# EAGLE design led_strip (EAGLE 5.06)
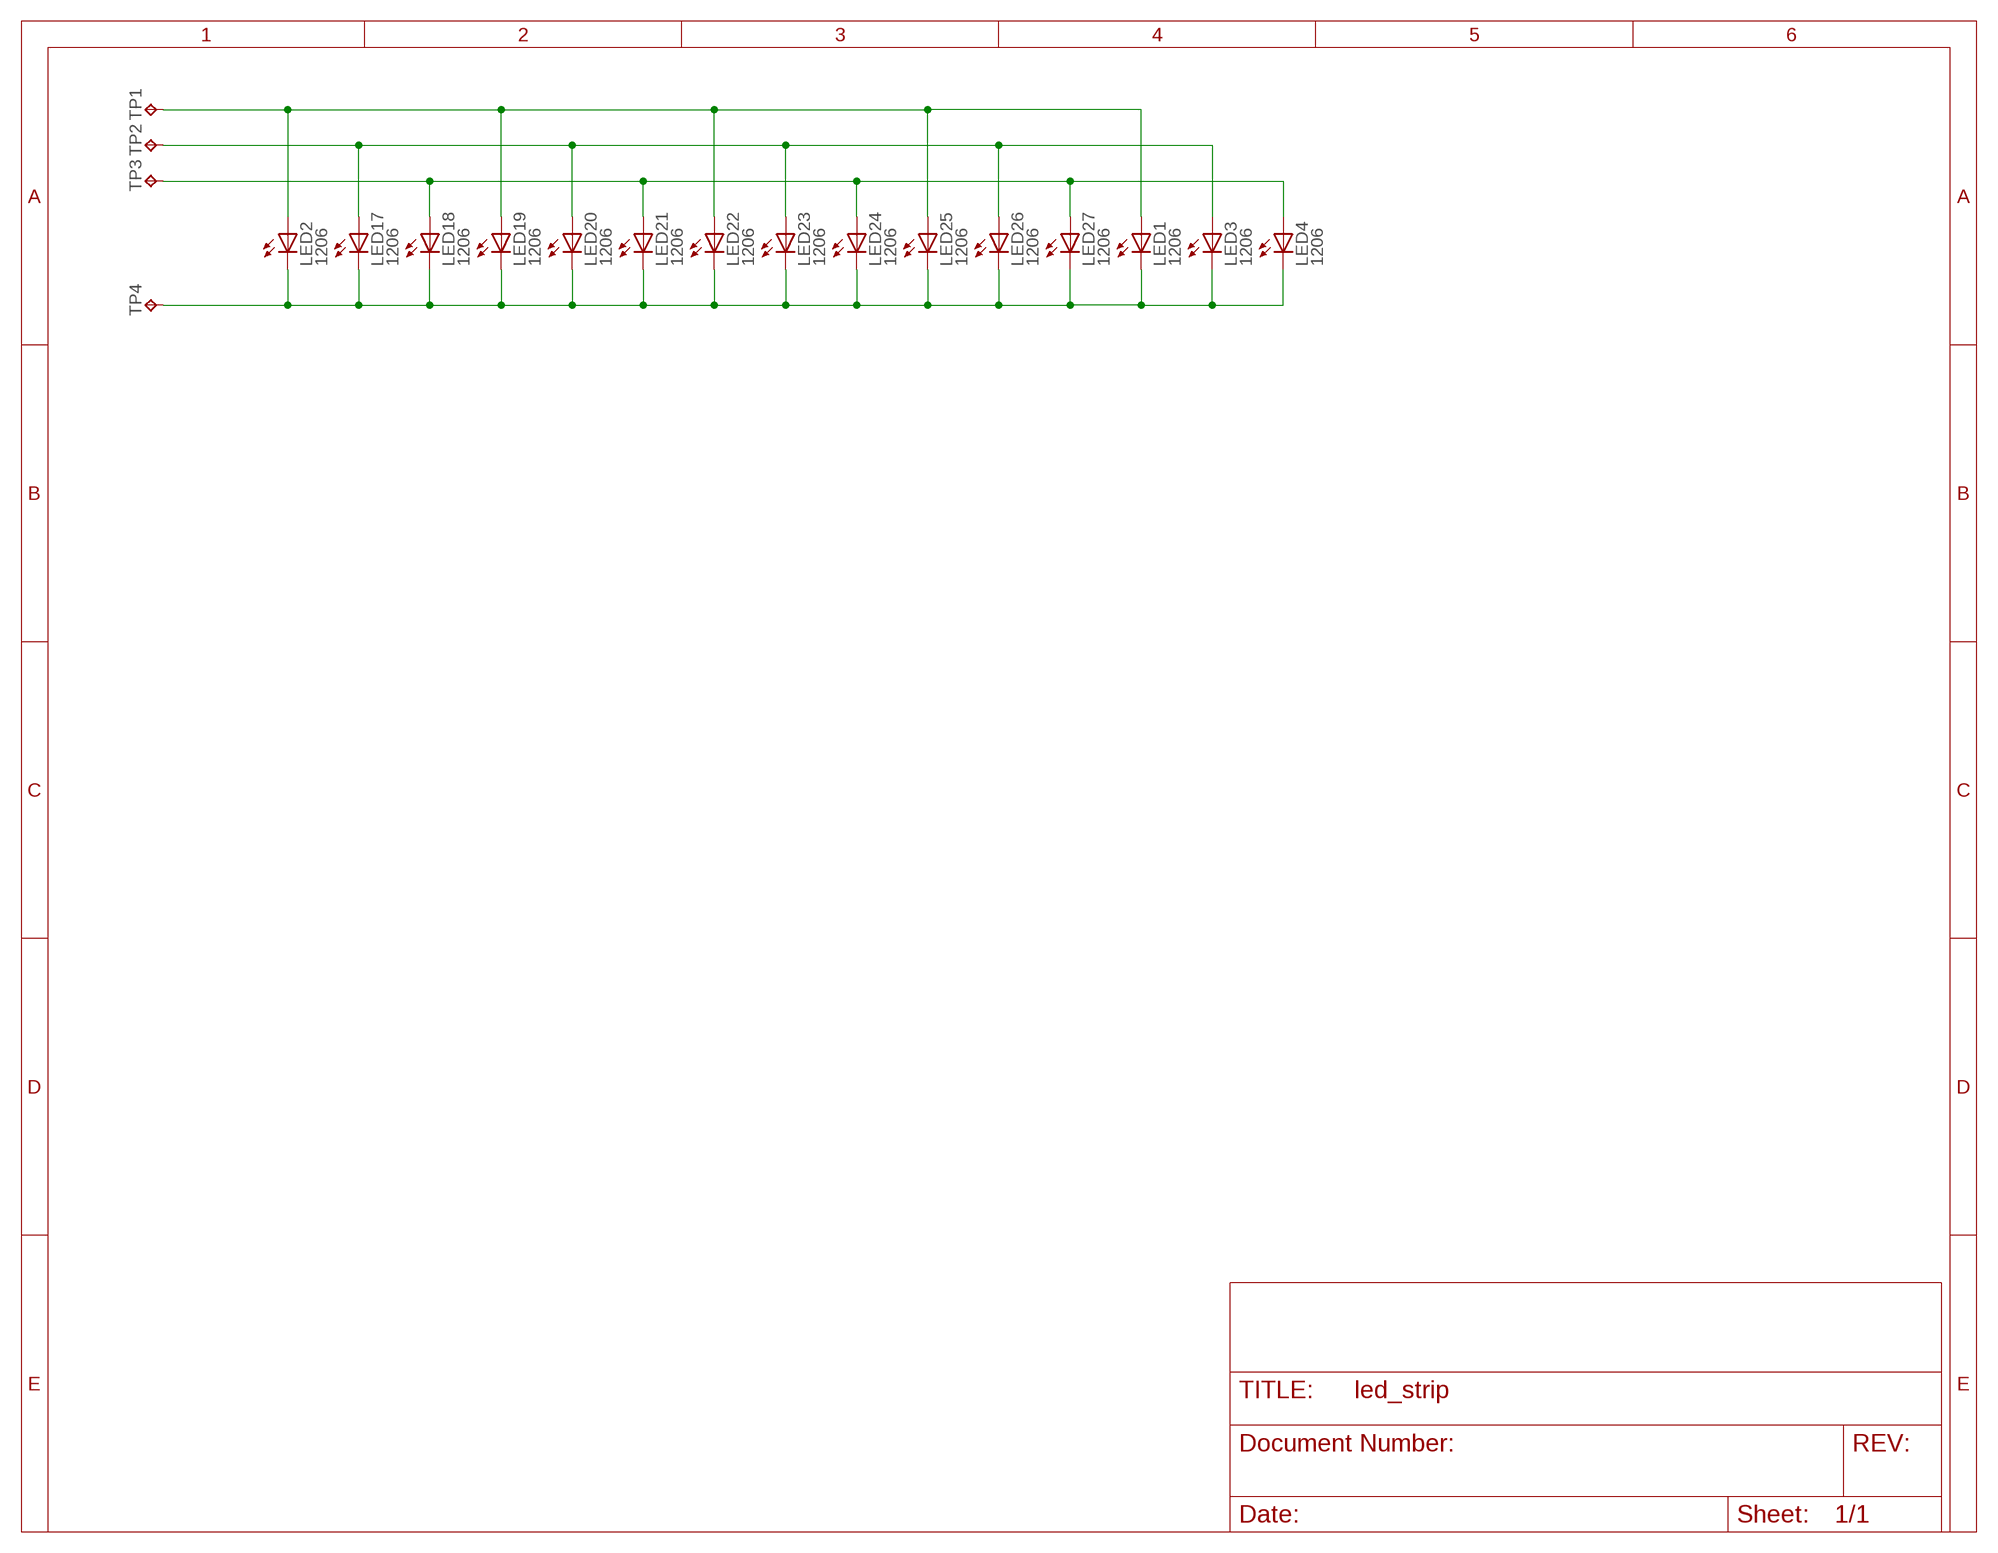
[diagram p0: schematic, sheet 1]

## Parts
LED1  1206  LEDSMT1206  [1206]
LED2  1206  LEDSMT1206  [1206]
LED3  1206  LEDSMT1206  [1206]
LED4  1206  LEDSMT1206  [1206]
LED17  1206  LEDSMT1206  [1206]
LED18  1206  LEDSMT1206  [1206]
LED19  1206  LEDSMT1206  [1206]
LED20  1206  LEDSMT1206  [1206]
LED21  1206  LEDSMT1206  [1206]
LED22  1206  LEDSMT1206  [1206]
LED23  1206  LEDSMT1206  [1206]
LED24  1206  LEDSMT1206  [1206]
LED25  1206  LEDSMT1206  [1206]
LED26  1206  LEDSMT1206  [1206]
LED27  1206  LEDSMT1206  [1206]
TP1  1.1  TPTP10SQ  [TP10SQ]
TP2  1.2  TPTP10SQ  [TP10SQ]
TP3  1.3  TPTP10SQ  [TP10SQ]
TP4  1.4  TPTP10SQ  [TP10SQ]

## Nets
LED1.1: LED1.A LED2.A LED19.A LED22.A LED25.A TP1.TP
LED1.2: LED3.A LED17.A LED20.A LED23.A LED26.A TP2.TP
LED1.3: LED4.A LED18.A LED21.A LED24.A LED27.A TP3.TP
LED1.4: LED1.C LED2.C LED3.C LED4.C LED17.C LED18.C LED19.C LED20.C LED21.C LED22.C LED23.C LED24.C LED25.C LED26.C LED27.C TP4.TP

## Library data of the parts
LED1-LED4 LED17-LED27 = led:LED: LED OSRAM: - CHIPLED LG R971, LG N971, LY N971, LG Q971, LY Q971, LO R971, LY R971 LH N974, LH R974 LS Q976, LO Q976, LY Q976 LO Q996 - Hyper CHIPLED LW Q18S LB Q993, LB Q99A, LB R99A - SideLED LS A670, LO A670, LY A670, LG A670, LP A670 LB A673, LV A673, LT A673, LW A673 LH A674 LY A675 LS A676, LA A676, LO A676, LY A676, LW A676 LS A679, LY A679, LG A679 - Hyper Micro SIDELED® LS Y876, LA Y876, LO Y876, LY Y876 LT Y87S - SmartLED LW L88C, LW L88S LB L89C, LB L89S, LG L890 LS L89K, LO L89K, LY L89K LS L896, LA L896, LO L896, LY L896 - TOPLED LS T670, LO T670, LY T670, LG T670, LP T670 LSG T670, LSP T670, LSY T670, LOP T670, LYG T670 LG T671, LOG T671, LSG T671 LB T673, LV T673, LT T673, LW T673 LH T674 LS T676, LA T676, LO T676, LY T676, LB T676, LH T676, LSB T676, LW T676 LB T67C, LV T67C, LT T67C, LS T67K, LO T67K, LY T67K, LW E67C LS E67B, LA E67B, LO E67B, LY E67B, LB E67C, LV E67C, LT E67C LW T67C LS T679, LY T679, LG T679 LS T770, LO T770, LY T770, LG T770, LP T770 LB T773, LV T773, LT T773, LW T773 LH T774 LS E675, LA E675, LY E675, LS T675 LS T776, LA T776, LO T776, LY T776, LB T776 LHGB T686 LT T68C, LB T68C - Hyper Mini TOPLED® LB M676 - Mini TOPLED Santana® LG M470 LS M47K, LO M47K, LY M47K Source: http://www.osram.convergy.de LUXEON: - LUMILED® LXK2-PW12-R00, LXK2-PW12-S00, LXK2-PW14-U00, LXK2-PW14-V00 LXK2-PM12-R00, LXK2-PM12-S00, LXK2-PM14-U00 LXK2-PE12-Q00, LXK2-PE12-R00, LXK2-PE12-S00, LXK2-PE14-T00, LXK2-PE14-U00 LXK2-PB12-K00, LXK2-PB12-L00, LXK2-PB12-M00, LXK2-PB14-N00, LXK2-PB14-P00, LXK2-PB14-Q00 LXK2-PR12-L00, LXK2-PR12-M00, LXK2-PR14-Q00, LXK2-PR14-R00 LXK2-PD12-Q00, LXK2-PD12-R00, LXK2-PD12-S00 LXK2-PH12-R00, LXK2-PH12-S00 LXK2-PL12-P00, LXK2-PL12-Q00, LXK2-PL12-R00 Source: www.luxeon.com KINGBRIGHT: KA-3528ASYC Source: www.kingbright.com
TP1-TP4 = testpad:TP: Test pad

## Board
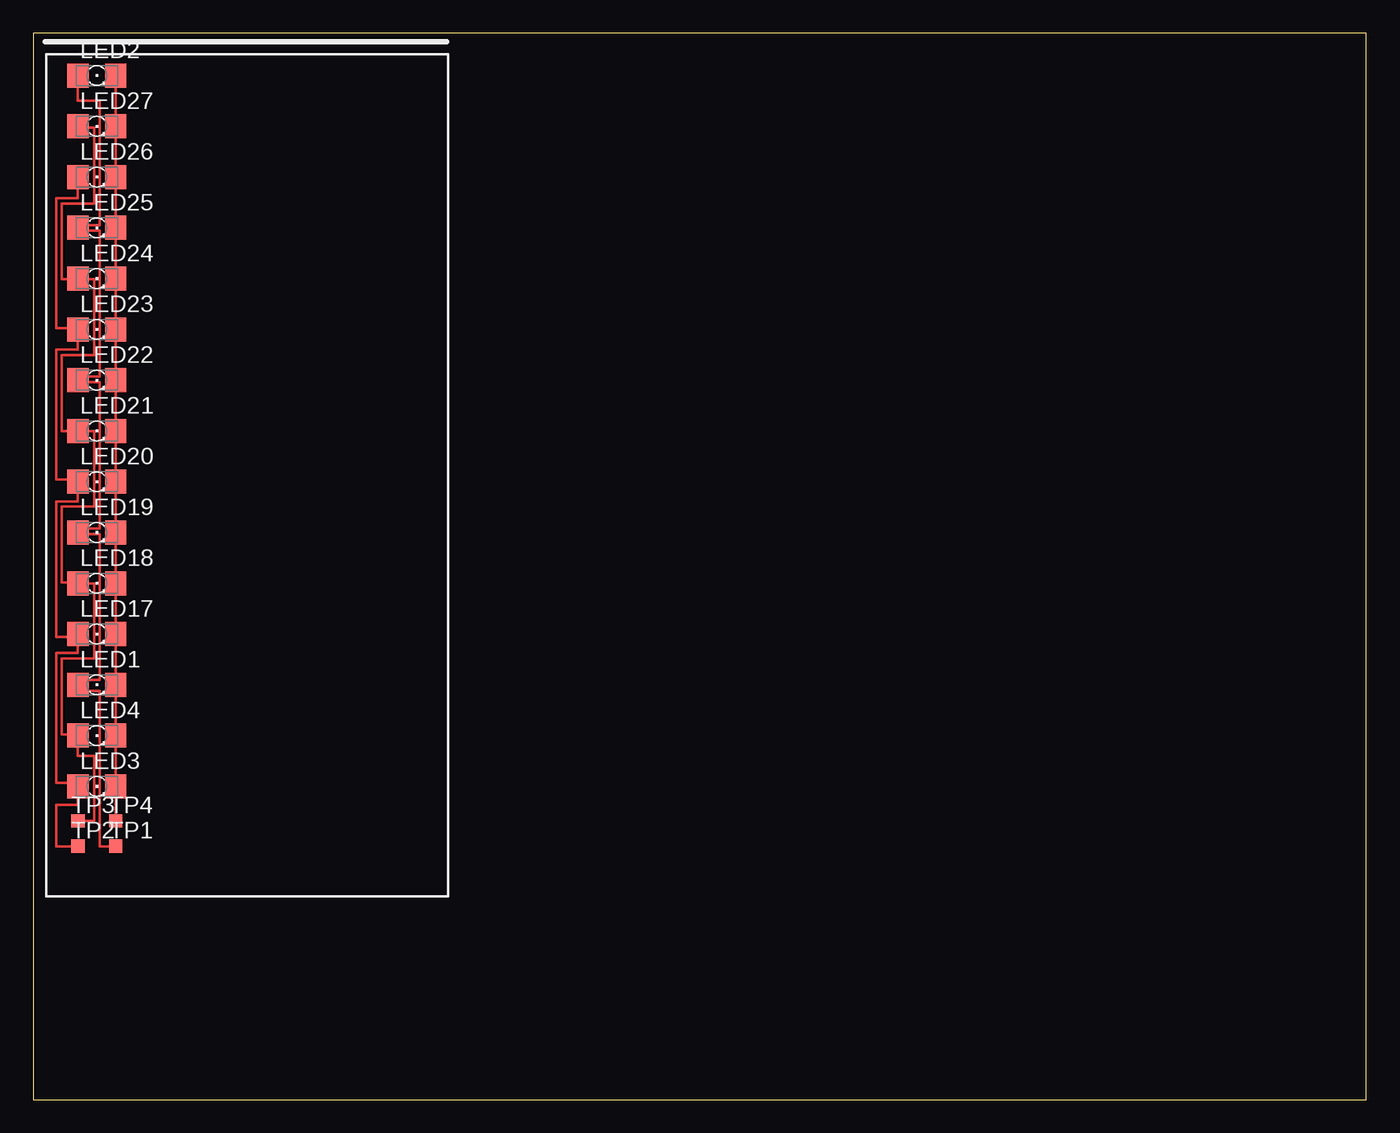
[diagram p1: board, top side]

Size 100 x 80 mm. Coordinates in mm from the lower left corner, seen from the top.
Outline: 0,0 100,0 100,80 0,80 0,0
Copper layers (1*16): Top 0.035mm / dielectric 1.5mm / Bottom 0.035mm
Design rules "default *": minimum track width 8mil, minimum drill 24mil, track to track 8mil, track to pad 8mil, pad to pad 8mil, via to via 8mil, smd to smd 8mil, copper to edge 40mil, drill to drill 8mil, minimum pad ring 10mil, minimum via ring 8mil, stop-mask expansion 4mil, vias tented up to drill 0mil, thermal gap 10mil

### Footprints (pad centres in the part's own frame; a part is rotated, then mirrored left to right if it is on the bottom)
1206 = smd 1.6 x 1.803: A -1.422,0; C 1.422,0
TP10SQ = smd 1 x 1: TP 0,0

### Placement (x,y rotation side)
LED1  4.76,31.12 0 top
LED2  4.76,76.83 0 top
LED3  4.76,23.5 0 top
LED4  4.76,27.31 0 top
LED17  4.76,34.92 0 top
LED18  4.76,38.73 0 top
LED19  4.76,42.55 0 top
LED20  4.76,46.35 0 top
LED21  4.76,50.16 0 top
LED22  4.76,53.98 0 top
LED23  4.76,57.78 0 top
LED24  4.76,61.59 0 top
LED25  4.76,65.41 0 top
LED26  4.76,69.22 0 top
LED27  4.76,73.03 0 top
TP1  6.18,19.01 0 top
TP2  3.34,19.01 0 top
TP3  3.34,20.9 0 top
TP4  6.18,20.9 0 top

### Tracks (layer width: path | path; a pad name or v marks a point on that pad's centre or on a via)
LED1.1
  Top 0.203: LED2.A 3.34,74.95 4.97,74.95 4.97,65.61 3.34,65.61 LED25.A 3.34,65.2 4.97,65.2 4.97,54.23 3.34,54.23 LED22.A 3.34,53.82 4.97,53.82 4.97,42.85 3.34,42.85 | 3.34,42.85 LED19.A | 3.34,42.85 3.75,42.85 3.75,42.44 4.97,42.44 4.97,31.47 3.34,31.47 | 3.34,31.47 LED1.A | 3.34,31.47 3.75,31.47 3.75,30.66 4.97,30.66 4.97,19.01 TP1.TP
LED1.2
  Top 0.203: LED26.A 3.34,67.64 1.71,67.64 1.71,57.89 3.34,57.89 LED23.A 3.34,56.26 1.71,56.26 1.71,46.51 3.34,46.51 LED20.A 3.34,44.88 1.71,44.88 1.71,34.72 | 1.71,34.72 3.34,34.72 LED17.A | 1.71,34.72 3.34,34.72 3.34,33.5 1.71,33.5 1.71,23.75 | 1.71,23.75 3.34,23.75 LED3.A | 1.71,23.75 3.34,23.75 3.34,22.12 1.71,22.12 1.71,19.01 TP2.TP
LED1.3
  Top 0.203: LED27.A 3.34,72.92 4.56,72.92 4.56,67.23 2.12,67.23 2.12,61.54 3.34,61.54 | 3.34,61.54 LED24.A 3.34,61.54 | 3.34,61.54 4.56,61.54 4.56,55.85 2.12,55.85 2.12,50.16 LED21.A | LED21.A | LED21.A 4.56,50.16 4.56,44.48 2.12,44.48 2.12,38.79 3.34,38.79 LED18.A 4.56,38.73 4.56,33.1 2.12,33.1 2.12,27.41 | 2.12,27.41 3.34,27.41 LED4.A | 2.12,27.41 3.34,27.41 3.34,25.78 4.56,25.78 4.56,20.9 TP3.TP
LED1.4
  Top 0.203: LED2.C LED27.C LED26.C LED25.C LED24.C LED23.C LED22.C LED21.C LED20.C LED19.C LED18.C LED17.C LED1.C LED4.C LED3.C | LED3.C 6.35,23.5 | TP4.TP LED3.C